# Altium schematic sheet Magnetometer.SchDoc
size A4
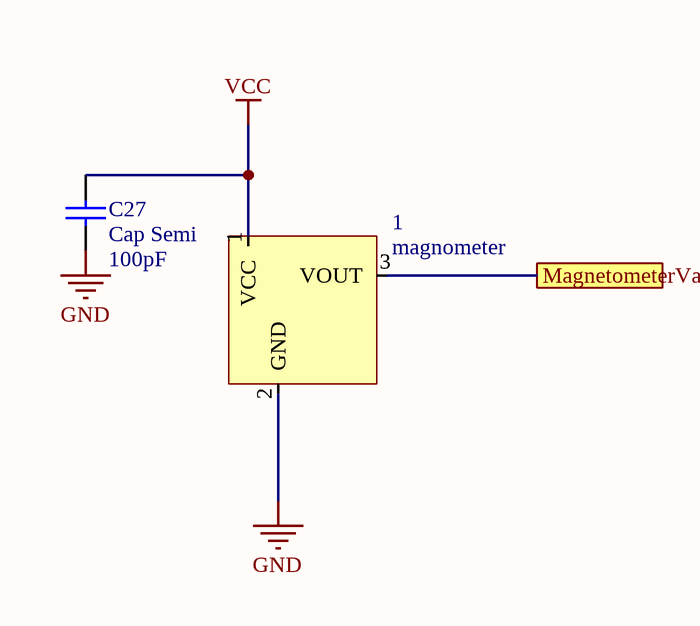
[diagram p0: Magnetometer.SchDoc]

## Parts
1  magnometer  [SIP-3]
C27  Cap Semi  value 100pF  [C1206]

## Ports
MagnetometerVal

## Nets
GND: 1.2(GND) C27.1
VCC: 1.1(VCC) C27.2
MagnetometerVal: 1.3(VOUT) ; port MagnetometerVal

## Library data of the parts
C27 = Cap Semi: Capacitor (Semiconductor SIM Model); Published: 8-Jun-2000; LatestRevisionDate: 29-May-2009; LatestRevisionNote: IPC-7351 Footprint Added.; PackageReference: C1206; Publisher: Altium Limited; PackageDescription: Chip Capacitor